# Altium schematic sheet COIL-BOOST-10A.SchDoc: COIL-BOOST-10A-XX (part 2 of 2)
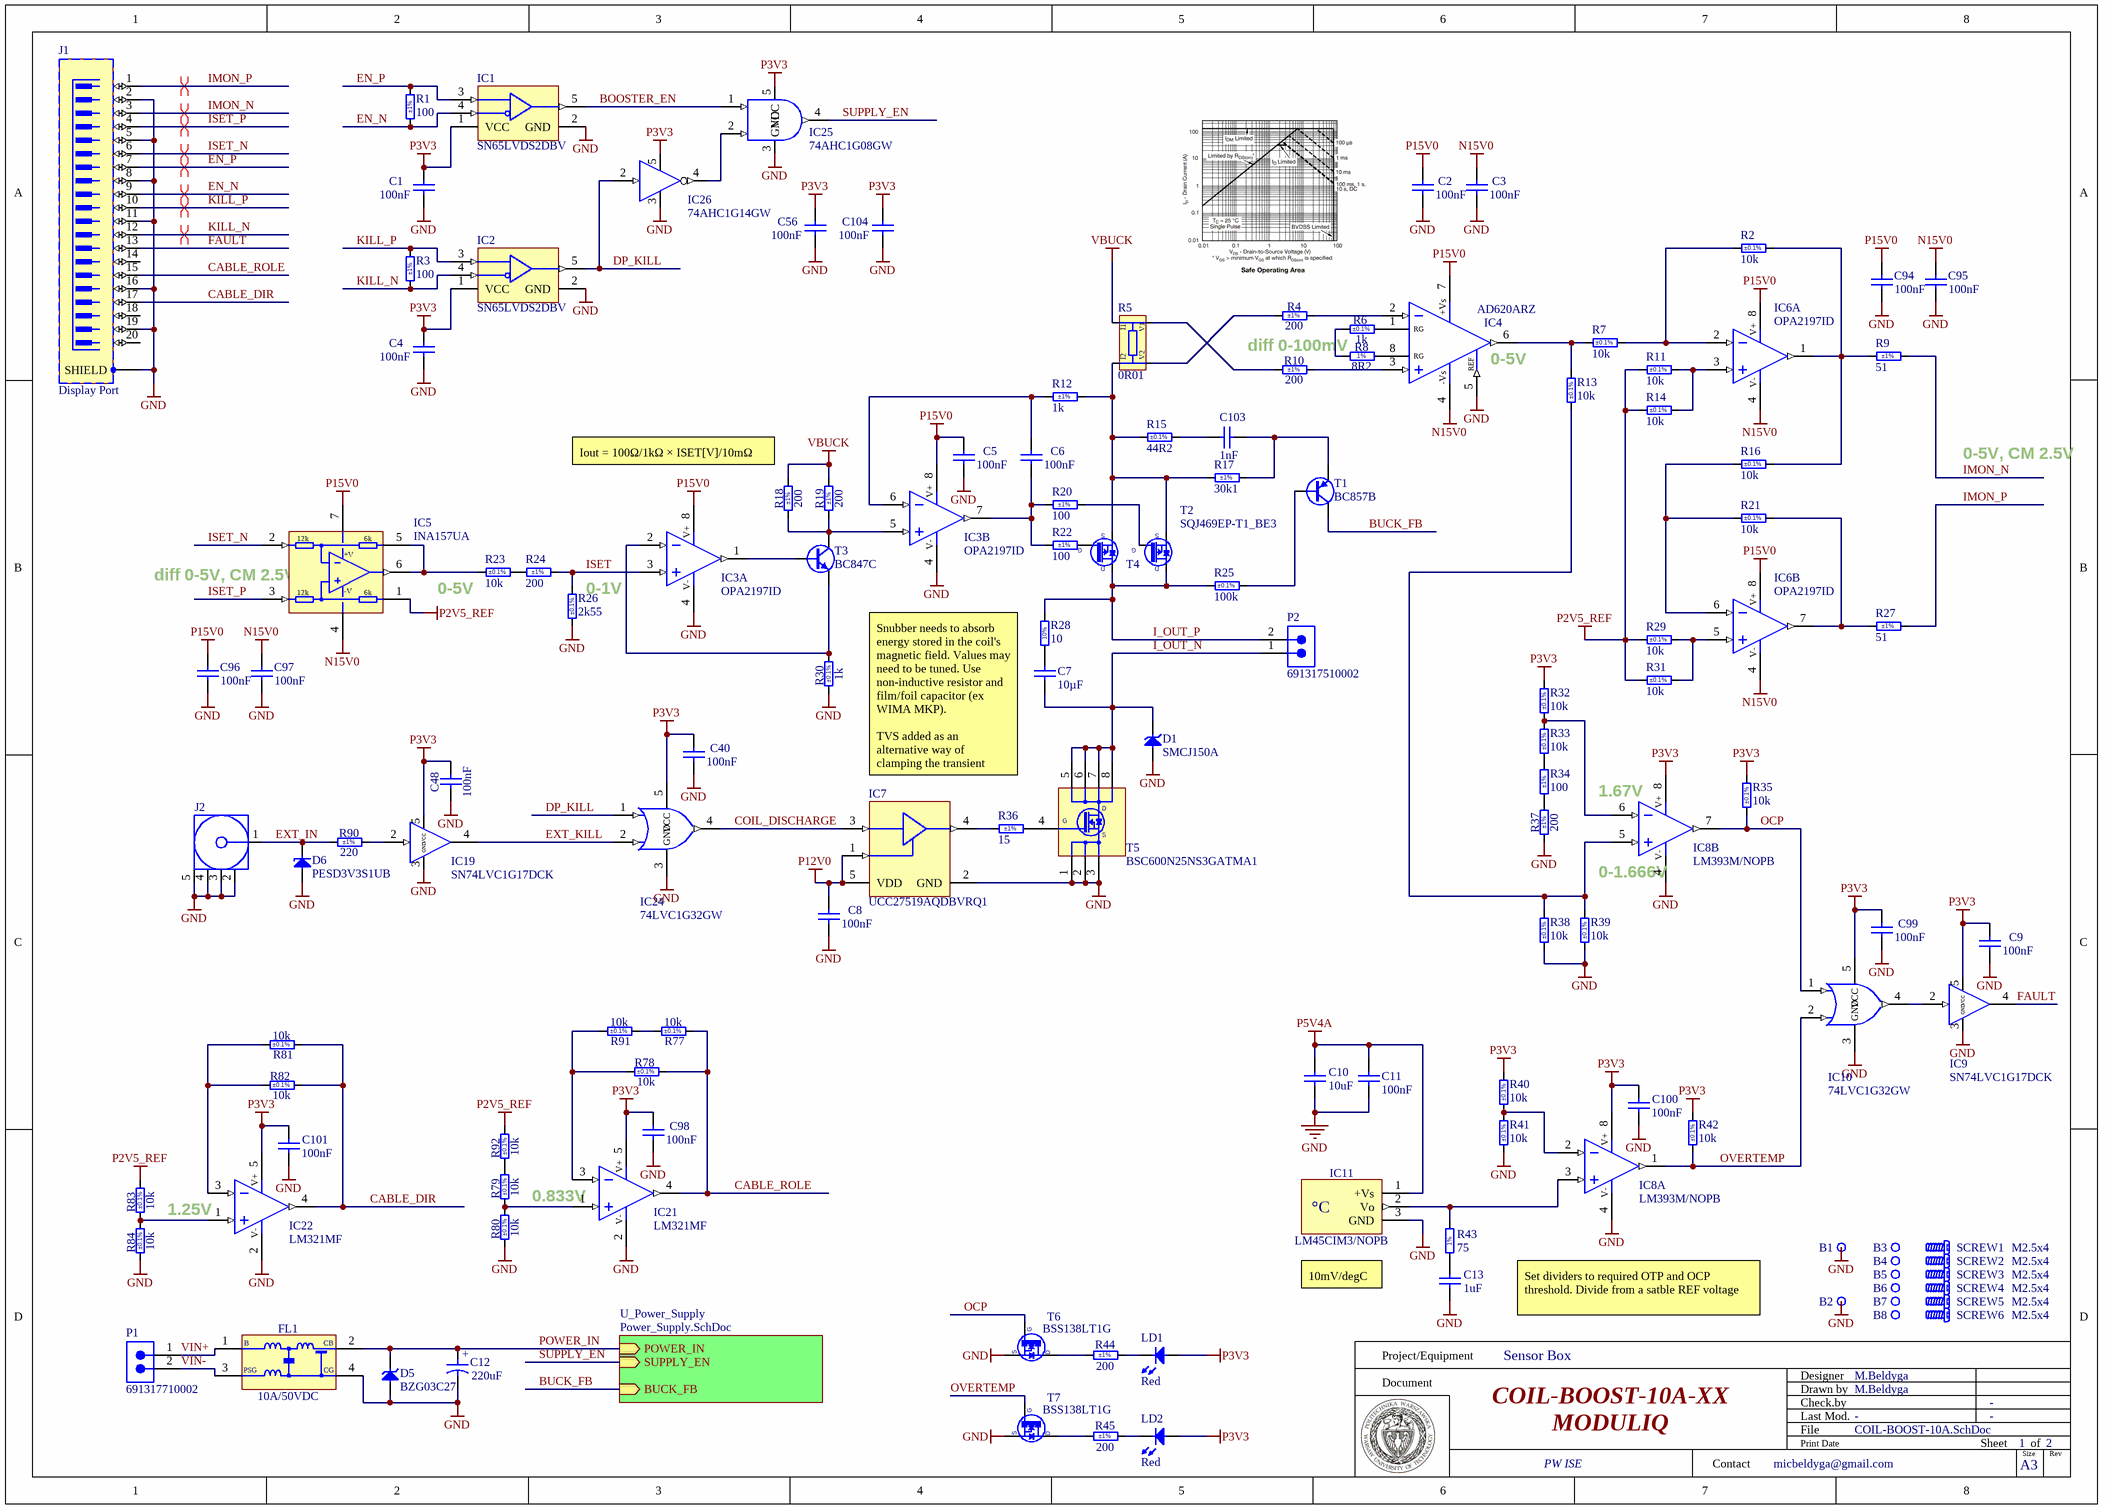
[diagram p1: COIL-BOOST-10A.SchDoc]

## Library data of the parts
B1-B8 = PLATED_HOLE2.7_PAD5.0: Single Terminal Socket; Part Description: Plated Through Hole: Hole Dia.=2.7mm Pad Dia.=5.0mm; Mounted: No; Part Number: PLATED_HOLE2.7_PAD5.0; Component Type: Standard (No BOM); Pin Count: 1; Family: Plated Hole; Socket: No; SMD: No; Sense: No; Status: None; ComponentHeight: 0mm; HelpURL: Undefined; Author: CERN DEM JMW; CreateDate: 27.09.2011; LatestRevisionDate: 27.09.2011; PackageDescription: Plated Through Hole: Hole Dia.=2.7mm Pad Dia.=5.0mm
C1-C6 C8 C9 C40 C56 C94-C101 C104 = CC0402_100NF_16V_10%_X5R: Non-polarised capacitor; Part Description: SMD Multilayer Chip Ceramic Capacitor; Manufacturer: GENERIC; Manufacturer1 Part Number: GRM155R61C104KA88D; Voltage: 16V; TC: X5R; Tolerance: ±10%; Part Number: CC0402_100NF_16V_10%_X5R; Component Kind: Standard; Component Type: Standard; Pin Count: 2; Value: 100nF; Status: None; Manufacturer Part Number: CC0402_100NF_16V_10%_X5R; Case: 0402; Mounted: Yes; Socket: No; SMD: Yes; Sense: No; Manufacturer1 Example: MURATA; Manufacturer1 ComponentHeight: 0.55mm; HelpURL: \\cern.ch\dfs\Applications\Altium\Datasheets\CC0402_X5R_MURATA_GRM.pdf; Author: CERN DEM JLC; CreateDate: 10.12.2013; LatestRevisionDate: 10.12.2013
C7 = R71XR510050H0K: Film Capacitor, Polypropylene, 450V, 10% +Tol, 10% -Tol, 10uF, Through Hole Mount; Manufacturer: KEMET; ESR (Equivalent Series Resistance): 10mΩ; Ripple Current: 8.68A; Voltage Rating (AC): 160V; Supplier: DigiKey; Supplier Part Number: 399-R71XR510050H0K-ND; Manufacturer Part Number: R71XR510050H0K; RoHS: Compliant; Category: Film Capacitors; Stock: 290; Pricing: 1=4.71, 10=3.387, 50=2.8622, 176=2.58898, 528=2.41778, 1056=2.33397, 2640=2.24539 (USD); Value: 10µF; Case/Package: Radial; Contact Plating: Tin; Dielectric Material: Polypropylene; Height: 28mm; Length: 32mm; Lifecycle Status: Production; Max Operating Temperature: 125°C; Min Operating Temperature: -55°C; Number of Terminals: 2; REACH SVHC: Yes; Terminal Pitch: 27.5mm; Voltage Rating (DC): 450V; Width: 14mm; ComponentLink1URL: https://datasheet.octopart.com:443/R71XR510050H0K-KEMET-datasheet-182036269.pdf?src-supplier=Newark; ComponentLink1Description: https://datasheet.octopart.com:443/R71XR510050H0K-KEMET-datasheet-182036269.pdf?src-supplier=Newark; ComponentLink2URL: https://datasheet.octopart.com:443/R71XR510050H0K-KEMET-datasheet-155475596.pdf?src-supplier=Newark; ComponentLink2Description: https://datasheet.octopart.com:443/R71XR510050H0K-KEMET-datasheet-155475596.pdf?src-supplier=Newark; ComponentLink3URL: https://datasheet.octopart.com:443/R71XR510050H0K-KEMET-datasheet-181969059.pdf?src-supplier=Farnell; ComponentLink3Description: https://datasheet.octopart.com:443/R71XR510050H0K-KEMET-datasheet-181969059.pdf?src-supplier=Farnell
C10 = CC0603_10UF_10V_10%_X5R: Non-polarised capacitor; Part Description: SMD Multilayer Chip Ceramic Capacitor; Manufacturer: GENERIC; Manufacturer1 Part Number: GRM188R61A106KE69D; Voltage: 10V; TC: X5R; Tolerance: ±10%; Part Number: CC0603_10UF_10V_10%_X5R; Component Kind: Standard; Component Type: Standard; Pin Count: 2; Value: 10uF; Status: None; Manufacturer Part Number: CC0603_10UF_10V_10%_X5R; Case: 0603; Mounted: Yes; Socket: No; SMD: Yes; Sense: No; Manufacturer1 Example: MURATA; Manufacturer1 ComponentHeight: 0.8mm; HelpURL: \\cern.ch\dfs\Applications\Altium\Datasheets\CC0603_MURATA_GRM188R61A106KE69D.pdf; Author: CERN DEM JLC; CreateDate: 31.01.2017; LatestRevisionDate: 31.01.2017
C11 = CC0402_100NF_50V_10%_X7R: Non-polarised capacitor; Part Description: SMD Multilayer Chip Ceramic Capacitor; Manufacturer: GENERIC; Manufacturer1 Part Number: GRM155R71H104KE14D; Voltage: 50V; TC: X7R; Tolerance: ±10%; Part Number: CC0402_100NF_50V_10%_X7R; Component Kind: Standard; Component Type: Standard; Pin Count: 2; Value: 100nF; Status: None; Manufacturer Part Number: CC0402_100NF_50V_10%_X7R; Case: 0402; Mounted: Yes; Socket: No; SMD: Yes; Sense: No; Manufacturer1 Example: MURATA; Manufacturer1 ComponentHeight: 0.55mm; HelpURL: \\cern.ch\dfs\Applications\Altium\Datasheets\CC0402_MURATA_GRM155R71H104KE14D.pdf; Author: CERN DEM MR; CreateDate: 6/30/2017; LatestRevisionDate: 6/30/2017
C12 = CAE830-620_220UF_16V_20%: Polarised capacitor; Part Description: Aluminum Electrolytic SMT Capacitor; Manufacturer: PANASONIC; Manufacturer Part Number: EEEFK1C221AP; Voltage: 16V; Tolerance: ±20%; Part Number: CAE830-620_220UF_16V_20%; Component Kind: Standard; Component Type: Standard; Pin Count: 2; Value: 220uF; Status: Not Recommended; Case: E; Mounted: Yes; Socket: No; SMD: Yes; Sense: No; ComponentHeight: 6.2mm; HelpURL: \\cern.ch\dfs\Applications\Altium\Datasheets\CAE_PANASONIC_FK.pdf; Author: CERN DEM JLC; CreateDate: 03.12.2007; LatestRevisionDate: 05.11.2014; Manufacturer1 Part Number: EEEFK1C221AP
C13 = CC0402_1UF_16V_10%_X5R: Non-polarised capacitor; Part Description: SMD Multilayer Chip Ceramic Capacitor; Manufacturer: GENERIC; Manufacturer1 Part Number: C1005X5R1C105KT; Voltage: 16V; TC: X5R; Tolerance: ±10%; Part Number: CC0402_1UF_16V_10%_X5R; Component Kind: Standard; Component Type: Standard; Pin Count: 2; Value: 1uF; Status: Preferred; Manufacturer Part Number: CC0402_1UF_16V_10%_X5R; Case: 0402; Mounted: Yes; Socket: No; SMD: Yes; Sense: No; Manufacturer1 Example: TDK; Manufacturer1 ComponentHeight: 0.55mm; HelpURL: \\cern.ch\dfs\Applications\Altium\Datasheets\CC0402_X5R_TDK_C.pdf; Author: CERN DEM JLC; CreateDate: 25.10.2012; LatestRevisionDate: 25.10.2012
C48 = CC0402_100NF_16V_10%_X7R: Non-polarised capacitor; Part Description: SMD Multilayer Chip Ceramic Capacitor; Manufacturer: GENERIC; Manufacturer1 Part Number: GRM155R71C104KA88D; Voltage: 16V; TC: X7R; Tolerance: ±10%; Part Number: CC0402_100NF_16V_10%_X7R; Component Kind: Standard; Component Type: Standard; Pin Count: 2; Value: 100nF; Status: Not Recommended; Manufacturer Part Number: CC0402_100NF_16V_10%_X7R; Case: 0402; Mounted: Yes; Socket: No; SMD: Yes; Sense: No; Manufacturer1 Example: MURATA; Manufacturer1 ComponentHeight: 0.55mm; HelpURL: \\cern.ch\dfs\Applications\Altium\Datasheets\CC0402_X7R_MURATA_GRM.pdf; Author: CERN DEM JLC; CreateDate: 05.12.2013; LatestRevisionDate: 03.12.2007
C103 = CC0402_1NF_50V_5%_C0G: Non-polarised capacitor; Part Description: SMD Multilayer Chip Ceramic Capacitor; Manufacturer: GENERIC; Manufacturer1 Part Number: C0402C102J5GACTU; Voltage: 50V; TC: C0G/NP0; Tolerance: ±5%; Part Number: CC0402_1NF_50V_5%_C0G; Component Kind: Standard; Component Type: Standard; Pin Count: 2; Value: 1nF; Status: Preferred; Manufacturer Part Number: CC0402_1NF_50V_5%_C0G; Case: 0402; Mounted: Yes; Socket: No; SMD: Yes; Sense: No; Manufacturer1 Example: KEMET; Manufacturer1 ComponentHeight: 0.55mm; HelpURL: \\cern.ch\dfs\Applications\Altium\Datasheets\CC0402_C0G_KEMET_(Commercial Grade).pdf; Author: CERN DEM BC; CreateDate: 9/2/2019; LatestRevisionDate: 9/2/2019
D1 = SMCJ150A: Transient Voltage Suppressor Diode (Uni-Directional); Part Description: Uni-Directional Transient Voltage Suppressor Diode; Manufacturer: LITTELFUSE; Voltage: 150V; Power: 1500W; PressFit: No; Bonding: No; Part Number: SMCJ150A; Component Kind: Standard; Component Type: Standard; Device: SMCJ150A; PackageDescription: DO-214-AB/SMC Molded Diode, Body 7.9x5.9mm, IPC Medium Density; Manufacturer Part Number: SMCJ150A; Pin Count: 2; Case: DO-214AB; Mounted: Yes; Socket: No; SMD: Yes; Sense: No; ComponentHeight: 2.62mm; HelpURL: \\cern.ch\dfs\Applications\Altium\Datasheets\SMCJ.pdf; Author: CERN DEM BC; CreateDate: 11/2/2015; LatestRevisionDate: 11/2/2015
D5 = BZG03C27: Zener Diode; Part Description: Voltage Regulator Diode; Manufacturer: VISHAY SEMICONDUCTORS; Voltage: 27V; Power: 1.25W; PressFit: No; Bonding: No; Part Number: BZG03C27; Component Kind: Standard; Component Type: Standard; Device: BZG03C27; PackageDescription: DO-214-AC/SMA Molded Diode, Body 5.3x2.6mm, IPC Medium Density; Manufacturer Part Number: BZG03C27; Pin Count: 2; Case: DO-214AC; Mounted: Yes; Socket: No; SMD: Yes; Sense: No; ComponentHeight: 2.3mm; HelpURL: \\cern.ch\dfs\Applications\Altium\Datasheets\BZG03C.pdf; Author: CERN DEM JLC; CreateDate: 6/2/2008; LatestRevisionDate: 6/2/2008
D6 = PESD3V3S1UB: ESD protection diode; Part Description: ESD protection diode (23kV); Manufacturer: NXP SEMICONDUCTORS; Voltage: 3V3; Power: 330W; PressFit: No; Bonding: No; Part Number: PESD3V3S1UB; Component Kind: Standard; Component Type: Standard; Device: PESD3V3S1UB; PackageDescription: Ultra Small Outline Diode Flat Lead (SOD-523), Body; 1.2mm L X 0.8mm W X 0.65mm H, IPC Medium Density; Manufacturer Part Number: PESD3V3S1UB; Pin Count: 2; Case: SOD523; Mounted: Yes; Socket: No; SMD: Yes; Sense: No; ComponentHeight: 0.65mm; HelpURL: \\cern.ch\dfs\Applications\Altium\Datasheets\PESD3V3S1UB.pdf; Author: CERN DEM JLC; CreateDate: 11/29/2012; LatestRevisionDate: 11/29/2012
FL1 = FIL_MURATA_BNX022-01L: Block Type EMIFIL (LC Combined); Part Description: Block Type EMIFIL (LC Combined) SMD Type, BNX02* Series; Manufacturer1: MURATA; Resistance: 0.5R; Part Number: FIL_MURATA_BNX022-01L; Component Kind: Standard; Component Type: Standard; Pin Count: 2; Value: 10A/50VDC; Status: None; Manufacturer1 Part Number: BNX022-01L; Mounted: Yes; Socket: No; SMD: Yes; Sense: No; ComponentHeight: 3.3mm; HelpURL: \\cern.ch\dfs\Applications\Altium\Datasheets\FIL_MURATA_BNX022-01L.pdf; Author: CERN DEM JLC; CreateDate: 10.10.2012; LatestRevisionDate: 10.10.2012
IC1 IC2 = SN65LVDS2DBVR: High-Speed Differential Line Receiver; Manufacturer: TEXAS INSTRUMENTS; PressFit: No; Bonding: No; Part Number: SN65LVDS2DBVR; Component Kind: Standard; Component Type: Standard; Device: SN65LVDS2DBV; PackageDescription: SOT, 0.95mm Pitch; 5 Pin, 1.60mm W X 2.90mm L X 1.45mm H body, IPC Medium Density; Part Description: High-Speed Differential Line Receiver; Manufacturer Part Number: SN65LVDS2DBV; Pin Count: 5; Case: SOT23-5; Mounted: Yes; Socket: No; SMD: Yes; Sense: No; ComponentHeight: 1.45mm; Author: CERN DEM JLC; HelpURL: \\cern.ch\dfs\Applications\Altium\Datasheets\SN65LVDS2DBVR.pdf; CreateDate: 3/3/2011; LatestRevisionDate: 3/3/2023
IC3 IC6 = OPA2197ID: Dual Operational Amplifier; Part Description: Dual, 36-V, Precision, Rail-to-Rail Input/Output, Low Offset Voltage, Operational Amplifiers; Manufacturer: TEXAS INSTRUMENTS; PressFit: No; Bonding: No; Part Number: OPA2197ID; Component Kind: Standard; Component Type: Standard; Device: OPA2197ID; PackageDescription: SOIC 8, Pitch 1.27mm - Body 4x5mm, IPC Medium Density; Manufacturer Part Number: OPA2197ID; Pin Count: 8; Case: SOIC8; Mounted: Yes; Socket: No; SMD: Yes; Sense: No; ComponentHeight: 1.75mm; Author: CERN DEM MR; HelpURL: \\cern.ch\dfs\Applications\Altium\Datasheets\OPA2197ID.pdf; CreateDate: 8/7/2019; LatestRevisionDate: 8/7/2019
IC4 = AD620ARZ: Low Cost Low Power Instrumentation Amplifier; Manufacturer1: ANALOG DEVICES; Manufacturer1 Part Number: AD620ARZ-REEL7; PressFit: No; Bonding: No; Part Number: AD620ARZ; Component Kind: Standard; Component Type: Standard; Device: AD620ARZ; PackageDescription: SOIC 8, Pitch 1.27mm - Body 4x5mm, IPC Medium Density; Part Description: Low Cost Low Power Instrumentation Amplifier; Pin Count: 8; Case: SOIC8; Mounted: Yes; Socket: No; SMD: Yes; Sense: No; ComponentHeight: 1.75mm; Author: CERN DEM JLC; HelpURL: \\cern.ch\dfs\Applications\Altium\Datasheets\AD620ARZ.pdf; CreateDate: 13.02.2017; LatestRevisionDate: 29.03.2022
IC5 = INA157UA: IC OPAMP DIFF 1 CIRCUIT 8SOIC Differential Amplifier 1 Circuit 8-SOIC; Manufacturer: Texas Instruments; Manufacturer Lifecycle Status: ACTIVE; -3db Bandwidth: 4MHz; Common Mode Rejection Ratio: 80dB; Dual Supply Voltage: 15V; Gain Bandwidth Product: 3MHz; Input Offset Voltage (Vos): 100µV; Max Dual Supply Voltage: 18V; Min Dual Supply Voltage: 4V; Min Supply Voltage: 8V; Nominal Supply Current: 2.4mA; Number of Amplifiers: 1; Number of Channels: 2; Output Current per Channel: 60mA; Value: 24kΩ; Settling Time: 2ns; Slew Rate: 14V/µs; Voltage Gain: 6.02dB; Supplier: DigiKey; Supplier Part Number: INA157UA-ND; Manufacturer Part Number: INA157UA; RoHS: Compliant; Category: Amplifiers - Op Amps, Buffer, Instrumentation; Stock: 608; Pricing: 1=3.99, 10=3.019, 75=2.55467, 150=2.44673, 300=2.35783, 525=2.2977, 1050=2.23519, 2550=2.17103 (USD); Case/Package: SOIC; Height: 1.75mm; Lead Free: Lead Free; Length: 4.9mm; Lifecycle Status: Production; Max Supply Voltage: 18V; Max Operating Temperature: 85°C; Min Input Voltage: 4V; Min Operating Temperature: -40°C; Number of Circuits: 1; Number of Elements: 1; Pins: 8; Operating Supply Current: 2.4mA; Quiescent Current: 2.4mA; Radiation Hardening: No; REACH SVHC: No; Thickness: 1.58mm; Weight: 75.891673mg; Width: 3.91mm; ComponentLink1URL: https://sigma.octopart.com:443/49249642/technical_drawing/Texas-Instruments-INA157UA.pdf?src-supplier=Texas+Instruments; ComponentLink1Description: https://sigma.octopart.com:443/49249642/technical_drawing/Texas-Instruments-INA157UA.pdf?src-supplier=Texas+Instruments; ComponentLink2URL: https://octopart.com:443/opatz8j6/c1?t=U1EGlDNQZqLQs-EwIsscqEEx-AfnVOllSlN4p0sh4PLdG1CcVMKRtmhTNlN5f_Uh_vUGKP152rEL5GLEXC8DNZuiG5tbL9tPH-teoooIFRknLMdlw0_Jv4zBSHnT4PvLcvwFqHgDMUmN8-CU-c3UHujaNllWAgd-PDXByNTyJSuUkuVnwLSvEPkd0Q_esnRAQitWnREmUgqmclHl2b6W6tCFcyWDuRzDd4IkS-8MZ59sgpEPanuaKX1qGjiQLPbd3OG0klFAyskjpNKaHTZEnEYEGL77h_GEymF0r_g3ACZDzpib4ELj8IvhiwXeMcRieELbSgYPCbUTcjZO1RvHbL2-kGPWqPzznfkJGrgq9ClaUaTRrtnm5Mq_6ye76DY4o9A&src-supplier=Texas+Instruments; ComponentLink2Description: https://octopart.com:443/opatz8j6/c1?t=U1EGlDNQZqLQs-EwIsscqEEx-AfnVOllSlN4p0sh4PLdG1CcVMKRtmhTNlN5f_Uh_vUGKP152rEL5GLEXC8DNZuiG5tbL9tPH-teoooIFRknLMdlw0_Jv4zBSHnT4PvLcvwFqHgDMUmN8-CU-c3UHujaNllWAgd-PDXByNTyJSuUkuVnwLSvEPkd0Q_esnRAQitWnREmUgqmclHl2b6W6tCFcyWDuRzDd4IkS-8MZ59sgpEPanuaKX1qGjiQLPbd3OG0klFAyskjpNKaHTZEnEYEGL77h_GEymF0r_g3ACZDzpib4ELj8IvhiwXeMcRieELbSgYPCbUTcjZO1RvHbL2-kGPWqPzznfkJGrgq9ClaUaTRrtnm5Mq_6ye76DY4o9A&src-supplier=Texas+Instruments; ComponentLink3URL: https://datasheet.octopart.com:443/INA157UA-Texas-Instruments-datasheet-152917.pdf?src-supplier=Texas+Instruments; ComponentLink3Description: https://datasheet.octopart.com:443/INA157UA-Texas-Instruments-datasheet-152917.pdf?src-supplier=Texas+Instruments; ComponentLink4URL: https://datasheet.octopart.com:443/INA157UA-Texas-Instruments-datasheet-10257352.pdf?src-supplier=element14+APAC; ComponentLink4Description: https://datasheet.octopart.com:443/INA157UA-Texas-Instruments-datasheet-10257352.pdf?src-supplier=element14+APAC; ComponentLink5URL: https://datasheet.octopart.com:443/INA157UA-Texas-Instruments-datasheet-30905.pdf?src-supplier=DigiKey; ComponentLink5Description: https://datasheet.octopart.com:443/INA157UA-Texas-Instruments-datasheet-30905.pdf?src-supplier=DigiKey; ComponentLink6URL: https://datasheet.octopart.com:443/INA157UA-Texas-Instruments-datasheet-14140569.pdf?src-supplier=iiiC; ComponentLink6Description: https://datasheet.octopart.com:443/INA157UA-Texas-Instruments-datasheet-14140569.pdf?src-supplier=iiiC; ComponentLink7URL: https://datasheet.octopart.com:443/INA157UA-Texas-Instruments-datasheet-8443426.pdf?src-supplier=Jameco; ComponentLink7Description: https://datasheet.octopart.com:443/INA157UA-Texas-Instruments-datasheet-8443426.pdf?src-supplier=Jameco; ComponentLink8URL: http://sigma.octopart.com:80/reach_statement/Texas-Instruments-company-64.pdf?src-supplier=Compliance+Statements; ComponentLink8Description: http://sigma.octopart.com:80/reach_statement/Texas-Instruments-company-64.pdf?src-supplier=Compliance+Statements; ComponentLink9URL: http://sigma.octopart.com:80/conflict_mineral_statement/Texas-Instruments-company-63.pdf?src-supplier=Compliance+Statements; ComponentLink9Description: http://sigma.octopart.com:80/conflict_mineral_statement/Texas-Instruments-company-63.pdf?src-supplier=Compliance+Statements
IC7 = UCC27519AQDBVRQ1: Single-Channel High-Speed Low-Side Gate Driver With Negative Input  Voltage Capability; Manufacturer: TEXAS INSTRUMENTS; PressFit: No; Bonding: No; Part Number: UCC27519AQDBVRQ1; Component Kind: Standard; Component Type: Standard; Device: UCC27519AQDBVRQ1; PackageDescription: SOT, 0.95mm Pitch; 5 pin, 1.60mm W X 2.90mm L X 1.45mm H body, IPC Medium Density; Part Description: Single-Channel High-Speed Low-Side Gate Driver with Negative Input  Voltage Capability; Manufacturer Part Number: UCC27519AQDBV; Pin Count: 5; Case: SOT23-5; Mounted: Yes; Socket: No; SMD: Yes; Sense: No; ComponentHeight: 1.45mm; Author: CERN DEM JLC; HelpURL: \\cern.ch\dfs\Applications\Altium\Datasheets\UCC27519AQDBVRQ1.pdf; CreateDate: 7/16/2018; LatestRevisionDate: 6/13/2022
IC8 = LM393M/NOPB: Dual Operational Amplifier; Part Description: Low Power Low Offset Voltage Dual Comparators; Manufacturer: NATIONAL SEMICONDUCTOR; Manufacturer Part Number: LM393M; PressFit: No; Bonding: No; Part Number: LM393M/NOPB; Component Kind: Standard; Component Type: Standard; Device: LM393M/NOPB; PackageDescription: SOIC 8, Pitch 1.27mm - Body 4x5mm, IPC Medium Density; Pin Count: 8; Case: SOIC8; Mounted: Yes; Socket: No; SMD: Yes; Sense: No; ComponentHeight: 1.75mm; Author: CERN DEM JLC; HelpURL: \\cern.ch\dfs\Applications\Altium\Datasheets\LM393M-NOPB.pdf; CreateDate: 11/18/2011; LatestRevisionDate: 6/2/2022
IC9 IC19 = SN74LVC1G17DCK: Single Schmitt-Trigger Buffer; Manufacturer: TEXAS INSTRUMENTS; PressFit: No; Bonding: No; Part Number: SN74LVC1G17DCK; Component Kind: Standard; Component Type: Standard; Device: SN74LVC1G17DCK; PackageDescription: SOT353, SC70-5, 0.65mm Pitch; 5 Pin, 1.25mm W X 2.00mm L X 1.10mm H body, IPC Medium Density; Part Description: Single Schmitt-Trigger Buffer; Manufacturer Part Number: SN74LVC1G17DCK; Pin Count: 5; Case: SOT353; Mounted: Yes; Socket: No; SMD: Yes; Sense: No; ComponentHeight: 1.45mm; Author: CERN DEM HF; HelpURL: \\cern.ch\dfs\Applications\Altium\Datasheets\SN74LVC1G17.pdf; CreateDate: 05.12.2024; LatestRevisionDate: 05.12.2024
IC10 IC24 = 74LVC1G32GW: Single 2-Input Positive-OR Gate; Part Description: Single 2-input OR gate; Manufacturer: NXP SEMICONDUCTORS; PressFit: No; Bonding: No; Part Number: 74LVC1G32GW; Component Kind: Standard; Component Type: Standard; Device: 74LVC1G32GW; PackageDescription: SOT353, SC70-5, 0.65mm Pitch; 5 Pin, 1.25mm W X 2.05mm L X 1.10mm H body, IPC Medium Density; Manufacturer Part Number: 74LVC1G32GW; Pin Count: 5; Case: SOT353; Mounted: Yes; Socket: No; SMD: Yes; Sense: No; ComponentHeight: 1.1mm; Author: CERN DEM JLC; HelpURL: \\cern.ch\dfs\Applications\Altium\Datasheets\74LVC1G32GW.pdf; CreateDate: 11/25/2013; LatestRevisionDate: 11/25/2013
IC11 = LM45CIM3/NOPB: -20° to +100°C ±3°C Precision Centigrade Temperature Sensors; Manufacturer: TEXAS INSTRUMENTS; PressFit: No; Bonding: No; Part Number: LM45CIM3/NOPB; Component Kind: Standard; Component Type: Standard; Device: LM45CIM3/NOPB; PackageDescription: SOT, 0.95mm Pitch; 3 Pin, 1.30mm W X 2.92mm L X 1.12mm H body, IPC Medium Density; Part Description: -20° to +100°C ±3°C Precision Centigrade Temperature Sensors; Manufacturer Part Number: LM45CIM3/NOPB; Pin Count: 3; Case: SOT23; Mounted: Yes; Socket: No; SMD: Yes; Sense: No; ComponentHeight: 1.12mm; HelpURL: \\cern.ch\dfs\Applications\Altium\Datasheets\LM45CIM3-NOPB.pdf; Author: CERN DEM JLC; CreateDate: 19/01/2011; LatestRevisionDate: 19/01/2011
IC21 IC22 = LM321MF/NOPB: Low Power Single Operational Amplifier; Manufacturer: TEXAS INSTRUMENTS; PressFit: No; Bonding: No; Part Number: LM321MF/NOPB; Component Kind: Standard; Component Type: Standard; Device: LM321MF; PackageDescription: SOT, 0.95mm Pitch; 5 Pin, 1.60mm W X 2.90mm L X 1.45mm H body, IPC Medium Density; Part Description: Low Power Single Operational Amplifier; Manufacturer Part Number: LM321MF; Pin Count: 5; Case: SOT23-5; Mounted: Yes; Socket: No; SMD: Yes; Sense: No; ComponentHeight: 1.45mm; Author: CERN DEM BC; HelpURL: \\cern.ch\dfs\Applications\Altium\Datasheets\LM321MF-NOPB.pdf; CreateDate: 9/4/2015; LatestRevisionDate: 6/1/2022
IC25 = 74AHC1G08GW: Single 2-Input AND Gate; Manufacturer: NXP SEMICONDUCTORS; PressFit: No; Bonding: No; Part Number: 74AHC1G08GW; Component Kind: Standard; Component Type: Standard; Device: 74AHC1G08GW; PackageDescription: SOT353, SC70-5, 0.65mm Pitch; 5 Pin, 1.25mm W X 2.05mm L X 1.10mm H body, IPC Medium Density; Part Description: Single 2-Input AND Gate; Manufacturer Part Number: 74AHC1G08GW; Pin Count: 5; Case: SOT353; Mounted: Yes; Socket: No; SMD: Yes; Sense: No; ComponentHeight: 1.1mm; Author: CERN DEM JLC; HelpURL: \\cern.ch\dfs\Applications\Altium\Datasheets\74AHC1G08GW.pdf; CreateDate: 8/31/2010; LatestRevisionDate: 8/31/2010
IC26 = 74AHC1G14GW: Single Schmitt-Trigger Inverter; Part Description: Inverting Schmitt Trigger; Manufacturer: NXP SEMICONDUCTORS; PressFit: No; Bonding: No; Part Number: 74AHC1G14GW; Component Kind: Standard; Component Type: Standard; Device: 74AHC1G14GW; PackageDescription: SOT353, SC70-5, 0.65mm Pitch; 5 Pin, 1.25mm W X 2.05mm L X 1.10mm H body, IPC Medium Density; Manufacturer Part Number: 74AHC1G14GW; Pin Count: 3; Case: SOT353; Mounted: Yes; Socket: No; SMD: Yes; Sense: No; ComponentHeight: 1.1mm; Author: CERN DEM JMW; HelpURL: \\cern.ch\dfs\Applications\Altium\Datasheets\74AHC1G14GW.pdf; CreateDate: 8/30/2016; LatestRevisionDate: 8/30/2016
J1 = MOLEX_47272-0001: Connector Mini DisplayPort 20 Male + 1 Shield; Part Description: 20 Circuits, 0.50mm Pitch, Right Angle DisplayPort Male Receptacle; Manufacturer: MOLEX; PressFit: No; Part Number: MOLEX_47272-0001; Component Kind: Standard; Component Type: Standard; Pin Count: 21; Family: Display Port; Mounted: Yes; Socket: No; SMD: Yes; Sense: No; Status: None; Manufacturer Part Number: 47272-0001; ComponentHeight: 5.63mm; HelpURL: \\cern.ch\dfs\Applications\Altium\Datasheets\MOLEX_47272-0001.pdf; Author: CERN DEM JLC; CreateDate: 2/5/2015; LatestRevisionDate: 2/5/2015
J2 = 60611002111502: WR-MCX PCB Jack, THT, Right Angle, Solder Leg 1.73mm; Manufacturer: Wurth Elektronik; Center Contact Diameter: 0.96mm; Connector Type: MCX; Frequency Range: DC~6GHz; Impedance: 50Ω; Interface Type: IEC 61169-36; ComponentLink1Description: Website Link; ComponentLink1URL: https://www.we-online.com/redexpert/article/60611002111502?ad; ComponentLink2Description: Datasheet Link; ComponentLink2URL: https://www.we-online.com/redexpert/spec/60611002111502?ad; Manufacturer Part Number: 60611002111502; Category: Coaxial Connectors; Match Code: WR-MCX; Mount: Through Hole; Operating Temperature Max: 155°C; Operating Temperature Min: -55°C; Packaging: Tray; Gender: Jack; Orientation: Right Angle
LD1 LD2 = LED_AVAGO_HSMC-C120: LED Red 1C 2A; Part Description: High Performance Right Angle Chip Red LED; Manufacturer: AVAGO TECHNOLOGIES; PressFit: No; Bonding: No; Part Number: LED_AVAGO_HSMC-C120; Component Kind: Standard; Component Type: Standard; Color: Red; PackageDescription: Red Chip LED, 2-Leads, Body 1.7x1.1mm, Side Emitting Package; Status: Not Recommended; Manufacturer Part Number: HSMC-C120; Pin Count: 2; Mounted: Yes; Socket: No; SMD: Yes; Sense: No; ComponentHeight: 0.7mm; HelpURL: \\cern.ch\dfs\Applications\Altium\Datasheets\LED_AVAGO_HSMC-C120.pdf; ComponentLink1URL: \\cern.ch\dfs\Applications\Altium\Datasheets\LED_AVAGO_HSMC-C120_DESIGN-GUIDE.pdf; ComponentLink1Description: Design Guide; Author: CERN DEM JMW; CreateDate: 7/22/2009; LatestRevisionDate: 6/20/2012
P1 = 691317710002: WR-TBL Series 3177 Close Horizontal PCB Header with Flanges, THT, pitch 5mm, 2p; Manufacturer: Wurth Elektronik; Modularity: No; Rated Current: 20A; Working Voltage: 300V; Manufacturer Part Number: 691317710002; Category: Terminal Blocks; Match Code: WR-TBL; ComponentLink1Description: Website Link; ComponentLink1URL: https://www.we-online.com/redexpert/article/691317710002?ad; ComponentLink2Description: Datasheet Link; ComponentLink2URL: https://www.we-online.com/redexpert/spec/691317710002?ad; Mount: Through Hole; Operating Temperature Max: 105°C; Operating Temperature Min: -40°C; Packaging: Box; Application: Pluggable; Number of Pins: 2; Number of Rows: 1; Orientation: Horizontal; Pitch: 5mm
P2 = 691317510002: WR-TBL Series 3175 Close Horizontal PCB Header with Flanges, THT, pitch 5.08mm, 2p; Manufacturer: Wurth Elektronik; Modularity: No; Rated Current: 20A; Working Voltage: 300V; Manufacturer Part Number: 691317510002; Category: Terminal Blocks; Match Code: WR-TBL; ComponentLink1Description: Website Link; ComponentLink1URL: https://www.we-online.com/redexpert/article/691317510002?ad; ComponentLink2Description: Datasheet Link; ComponentLink2URL: https://www.we-online.com/redexpert/spec/691317510002?ad; Mount: Through Hole; Operating Temperature Max: 105°C; Operating Temperature Min: -40°C; Packaging: Box; Application: Pluggable; Number of Pins: 2; Number of Rows: 1; Orientation: Horizontal; Pitch: 5.08mm
R1 R3 R20 R22 R34 = R0402_100R_1%_0.0625W_100PPM: Resistor - 1%; Part Description: General Purpose Thick Film Chip Resistor; Manufacturer: GENERIC; Manufacturer1 Part Number: 232270671001L; TC: ±100ppm/°C; PressFit: No; Part Number: R0402_100R_1%_0.0625W_100PPM; Component Kind: Standard; Component Type: Standard; Pin Count: 2; Value: 100; Status: Not Recommended; Power: 0.0625W; Manufacturer Part Number: R0402_100R_1%_0.0625W_100PPM; Case: 0402; Mounted: Yes; Sense: No; Socket: No; SMD: Yes; Manufacturer1 Example: YAGEO PHYCOMP; Manufacturer1 ComponentHeight: 0.4mm; HelpURL: \\cern.ch\dfs\Applications\Altium\Datasheets\R0402_Phycomp_RC0402.pdf; Author: CERN DEM JLC; CreateDate: 12/3/2007; LatestRevisionDate: 10/17/2012
R2 R7 R11 R13 R14 R16 R21 R23 R29 R31-R33 R35 R38-R42 R77-R84 R91 R92 = R0402_10K_0.1%_0.063W_25PPM: Resistor - 0.1%; Part Description: Thin Film Precision Resistor; Manufacturer: GENERIC; Manufacturer1 Part Number: CPF0402B10KE1; Power: 0.063W; TC: ±25ppm/°C; PressFit: No; Part Number: R0402_10K_0.1%_0.063W_25PPM; Component Kind: Standard; Component Type: Standard; Pin Count: 2; Value: 10k; Status: Not Recommended; Manufacturer Part Number: R0402_10K_0.1%_0.063W_25PPM; Case: 0402; Mounted: Yes; Sense: No; Socket: No; SMD: Yes; Manufacturer1 Example: TE CONNECTIVITY; Manufacturer1 ComponentHeight: 0.35mm; HelpURL: \\cern.ch\dfs\Applications\Altium\Datasheets\R0402_TYCO_CPF.pdf; Author: CERN DEM JMW; CreateDate: 9/22/2015; LatestRevisionDate: 9/22/2015
R4 R10 R18 R19 R37 R44 R45 = R0603_200R_1%_0.1W_100PPM: Resistor - 1%; Part Description: General Purpose Thick Film Chip Resistor; Manufacturer: GENERIC; Manufacturer1: Vishay; Manufacturer1 Part Number: CRCW0603200RFKEA; Power: 0.1W; TC: ±100ppm/°C; PressFit: No; Part Number: R0603_200R_1%_0.1W_100PPM; Component Kind: Standard; Component Type: Standard; Pin Count: 2; Value: 200; Status: Preferred; Manufacturer Part Number: R0603_200R_1%_0.1W_100PPM; Case: 0603; Mounted: Yes; Sense: No; Socket: No; SMD: Yes; Manufacturer1 ComponentHeight: 0.55mm; HelpURL: \\cern.ch\dfs\Applications\Altium\Datasheets\R0603_NIC_NRC.pdf; Author: CERN DEM JLC; CreateDate: 03.12.2007; LatestRevisionDate: 13.03.2008
R5 = R_0R01_1%_2W_100PPM_OHMITE_LVK25: Power and Current Sensing Resistor; Part Description: Four Terminal High Precision Current Sense; Manufacturer: OHMITE; Manufacturer Part Number: LVK25R010FER; Power: 2W; TC: ±100ppm/°C; Tolerance: ±1%; PressFit: No; Part Number: R_0R01_1%_2W_100PPM_OHMITE_LVK25; Component Kind: Standard; Component Type: Standard; Pin Count: 4; Value: 0R01; Status: None; Mounted: Yes; Sense: No; Socket: No; SMD: Yes; ComponentHeight: 0.7mm; HelpURL: \\cern.ch\dfs\Applications\Altium\Datasheets\R_OHMITE_LVK25.pdf; Author: CERN DEM BC; CreateDate: 9/7/2020; LatestRevisionDate: 9/7/2020
R6 R30 = R0603_1K_0.1%_0.063W_10PPM: Resistor - 0.1%; Part Description: Thin Film Chip Resistor; Manufacturer: GENERIC; Manufacturer1: TYCO HOLSWORTHY; Manufacturer1 Part Number: RN73C1J1K0BTG; Power: 0.063W; TC: ±10ppm; PressFit: No; Part Number: R0603_1K_0.1%_0.063W_10PPM; Component Kind: Standard; Component Type: Standard; Pin Count: 2; Value: 1k; Status: Not Recommended; Manufacturer Part Number: R0603_1K_0.1%_0.063W_10PPM; Case: 0603; Mounted: Yes; Sense: No; Socket: No; SMD: Yes; Manufacturer1 ComponentHeight: 0.55mm; HelpURL: \\cern.ch\dfs\Applications\Altium\Datasheets\R0603_Tyco_RN73.pdf; Author: CERN DEM BC; CreateDate: 23.05.2016; LatestRevisionDate: 23.05.2016
R8 = R0603_8R2_1%_0.1W_200PPM: Resistor - 1%; Part Description: General Purpose Thick Film Chip Resistor; Manufacturer: GENERIC; Manufacturer1: YAGEO PHYCOMP; Manufacturer1 Part Number: RC0603FR-078R2L; Power: 0.1W; TC: ±200ppm/°C; PressFit: No; Part Number: R0603_8R2_1%_0.1W_200PPM; Component Kind: Standard; Component Type: Standard; Pin Count: 2; Value: 8R2; Status: Preferred; Tolerance: ±1%; Manufacturer Part Number: R0603_8R2_1%_0.1W_200PPM; Case: 0603; Mounted: Yes; Sense: No; Socket: No; SMD: Yes; Manufacturer1 ComponentHeight: 0.65mm; HelpURL: \\cern.ch\dfs\Applications\Altium\Datasheets\R0603_Phycomp_RC0603.pdf; Author: CERN DEM JLC; CreateDate: 03/12/2007; LatestRevisionDate: 17/10/2012
R9 R27 = R0603_51R_1%_0.1W_100PPM: Resistor - 1%; Part Description: General Purpose Thick Film Chip Resistor; Manufacturer: GENERIC; Manufacturer1 Part Number: NRC06F51R0TRF; Power: 0.1W; TC: ±100ppm/°C; PressFit: No; Part Number: R0603_51R_1%_0.1W_100PPM; Component Kind: Standard; Component Type: Standard; Pin Count: 2; Value: 51; Status: Preferred; Manufacturer Part Number: R0603_51R_1%_0.1W_100PPM; Case: 0603; Mounted: Yes; Sense: No; Socket: No; SMD: Yes; Manufacturer1 Example: NIC COMPONENT; Manufacturer1 ComponentHeight: 0.55mm; HelpURL: \\cern.ch\dfs\Applications\Altium\Datasheets\R0603_NIC_NRC.pdf; Author: CERN DEM JLC; CreateDate: 12/3/2007; LatestRevisionDate: 3/13/2008
R12 = R0402_1K_1%_0.0625W_100PPM: Resistor - 1%; Part Description: General Purpose Thick Film Chip Resistor; Manufacturer: GENERIC; Manufacturer1 Part Number: 232270671002L; TC: ±100ppm/°C; PressFit: No; Part Number: R0402_1K_1%_0.0625W_100PPM; Component Kind: Standard; Component Type: Standard; Pin Count: 2; Value: 1k; Status: Not Recommended; Power: 0.0625W; Manufacturer Part Number: R0402_1K_1%_0.0625W_100PPM; Case: 0402; Mounted: Yes; Sense: No; Socket: No; SMD: Yes; Manufacturer1 Example: YAGEO PHYCOMP; Manufacturer1 ComponentHeight: 0.4mm; HelpURL: \\cern.ch\dfs\Applications\Altium\Datasheets\R0402_Phycomp_RC0402.pdf; Author: CERN DEM JLC; CreateDate: 12/3/2007; LatestRevisionDate: 10/17/2012
R15 = R0603_44R2_0.1%_0.063W_10PPM: Resistor - 0.1%; Part Description: Thin Film Chip Resistor; Manufacturer: GENERIC; Manufacturer1 Part Number: RN73C1J44R2BTDF; Power: 0.063W; TC: ±10ppm; PressFit: No; Part Number: R0603_44R2_0.1%_0.063W_10PPM; Component Kind: Standard; Component Type: Standard; Pin Count: 2; Value: 44R2; Status: Not Recommended; Manufacturer Part Number: R0603_44R2_0.1%_0.063W_10PPM; Case: 0603; Mounted: Yes; Sense: No; Socket: No; SMD: Yes; Manufacturer1 Example: TYCO HOLSWORTHY; Manufacturer1 ComponentHeight: 0.5mm; HelpURL: \\cern.ch\dfs\Applications\Altium\Datasheets\R0603_Tyco_RN73.pdf; Author: CERN DEM JLC; CreateDate: 12/3/2007; LatestRevisionDate: 3/13/2008
R17 = R0402_30K1_1%_0.0625W_100PPM: Resistor - 1%; Part Description: General Purpose Thick Film Chip Resistor; Manufacturer: GENERIC; Manufacturer1 Part Number: RC0402FR-0730K1L; TC: ±100ppm/°C; PressFit: No; Part Number: R0402_30K1_1%_0.0625W_100PPM; Component Kind: Standard; Component Type: Standard; Pin Count: 2; Value: 30k1; Status: Preferred; Power: 0.0625W; Manufacturer Part Number: R0402_30K1_1%_0.0625W_100PPM; Case: 0402; Mounted: Yes; Sense: No; Socket: No; SMD: Yes; Manufacturer1 Example: YAGEO PHYCOMP; Manufacturer1 ComponentHeight: 0.4mm; HelpURL: \\cern.ch\dfs\Applications\Altium\Datasheets\R0402_YAGEO_RC_L.pdf; Author: CERN DEM BC; CreateDate: 3/16/2021; LatestRevisionDate: 3/16/2021
R24 = R0603_200R_1%_0.1W_100PPM: Resistor - 1%; Part Description: General Purpose Thick Film Chip Resistor; Manufacturer: GENERIC; Manufacturer1 Part Number: NRC06F2000TRF; Power: 0.1W; TC: ±100ppm/°C; PressFit: No; Part Number: R0603_200R_1%_0.1W_100PPM; Component Kind: Standard; Component Type: Standard; Pin Count: 2; Value: 200; Status: Preferred; Manufacturer Part Number: R0603_200R_1%_0.1W_100PPM; Case: 0603; Mounted: Yes; Sense: No; Socket: No; SMD: Yes; Manufacturer1 Example: NIC COMPONENT; Manufacturer1 ComponentHeight: 0.55mm; HelpURL: \\cern.ch\dfs\Applications\Altium\Datasheets\R0603_NIC_NRC.pdf; Author: CERN DEM JLC; CreateDate: 12/3/2007; LatestRevisionDate: 3/13/2008
R25 = R0402_100K_0.1%_0.063W_25PPM: Resistor - 0.1%; Part Description: Thin Film Precision Resistor; Manufacturer: GENERIC; Manufacturer1 Part Number: CPF0402B100KE1; Power: 0.063W; TC: ±25ppm/°C; PressFit: No; Part Number: R0402_100K_0.1%_0.063W_25PPM; Component Kind: Standard; Component Type: Standard; Pin Count: 2; Value: 100k; Status: Not Recommended; Manufacturer Part Number: R0402_100K_0.1%_0.063W_25PPM; Case: 0402; Mounted: Yes; Sense: No; Socket: No; SMD: Yes; Manufacturer1 Example: TE CONNECTIVITY; Manufacturer1 ComponentHeight: 0.35mm; HelpURL: \\cern.ch\dfs\Applications\Altium\Datasheets\R0402_TYCO_CPF.pdf; Author: CERN DEM JMW; CreateDate: 9/22/2015; LatestRevisionDate: 9/22/2015
R26 = R0603_2K55_0.1%_0.063W_10PPM: Resistor - 0.1%; Part Description: Thin Film Chip Resistor; Manufacturer: GENERIC; Manufacturer1 Part Number: RN73C1J2K55BTDF; Power: 0.063W; TC: ±10ppm; PressFit: No; Part Number: R0603_2K55_0.1%_0.063W_10PPM; Component Kind: Standard; Component Type: Standard; Pin Count: 2; Value: 2k55; Status: Not Recommended; Manufacturer Part Number: R0603_2K55_0.1%_0.063W_10PPM; Case: 0603; Mounted: Yes; Sense: No; Socket: No; SMD: Yes; Manufacturer1 Example: TYCO HOLSWORTHY; Manufacturer1 ComponentHeight: 0.5mm; HelpURL: \\cern.ch\dfs\Applications\Altium\Datasheets\R0603_Tyco_RN73.pdf; Author: CERN DEM JLC; CreateDate: 12/3/2007; LatestRevisionDate: 3/13/2008
R28 = RCF_10R_10%_2W_-1300±300PPM_OHMITE_OY: Resistor - 10%; Part Description: Ceramic Composition Resistor - OY Series; Manufacturer: OHMITE; Manufacturer Part Number: OY100KE; Power: 2W; TC: -1300±300ppm/°C; PressFit: No; Part Number: RCF_10R_10%_2W_-1300±300PPM_OHMITE_OY; Component Kind: Standard; Component Type: Standard; Footprint: RES_OHMITE_OY; Pin Count: 2; Value: 10; Status: Not recommended; Tolerance: ±10%; Case: LS30 L22.5 x D8; Mounted: Yes; Sense: No; Socket: No; SMD: No; ComponentHeight: 8mm; HelpURL: \\cern.ch\dfs\Applications\Altium\Datasheets\RCF_OHMITE_OY.pdf; Author: CERN DEM MR; CreateDate: 5/13/2016; LatestRevisionDate: 5/13/2016
R36 = R1206_15R_1%_0.25W_100PPM: Resistor - 1%; Part Description: General Purpose Thick Film Chip Resistor; Manufacturer: GENERIC; Manufacturer1 Part Number: NRC12F15R0TRF; Power: 0.25W; TC: ±100ppm/°C; PressFit: No; Part Number: R1206_15R_1%_0.25W_100PPM; Component Kind: Standard; Component Type: Standard; Pin Count: 2; Value: 15; Status: Preferred; Manufacturer Part Number: R1206_15R_1%_0.25W_100PPM; Case: 1206; Mounted: Yes; Sense: No; Socket: No; SMD: Yes; Manufacturer1 Example: NIC COMPONENT; Manufacturer1 ComponentHeight: 0.65mm; HelpURL: \\cern.ch\dfs\Applications\Altium\Datasheets\R1206_NIC_NRC.pdf; Author: CERN DEM JLC; CreateDate: 12/3/2007; LatestRevisionDate: 3/13/2008
R43 = R0402_75R_1%_0.0625W_100PPM: Resistor - 1%; Part Description: General Purpose Thick Film Chip Resistor; Manufacturer: GENERIC; Manufacturer1 Part Number: 232270677509L; TC: ±100ppm/°C; PressFit: No; Part Number: R0402_75R_1%_0.0625W_100PPM; Component Kind: Standard; Component Type: Standard; Pin Count: 2; Value: 75; Status: Not Recommended; Power: 0.0625W; Tolerance: ±1%; Manufacturer Part Number: R0402_75R_1%_0.0625W_100PPM; Case: 0402; Mounted: Yes; Sense: No; Socket: No; SMD: Yes; Manufacturer1 Example: YAGEO PHYCOMP; Manufacturer1 ComponentHeight: 0.4mm; HelpURL: \\cern.ch\dfs\Applications\Altium\Datasheets\R0402_Phycomp_RC0402.pdf; Author: CERN DEM JLC; CreateDate: 03/12/2007; LatestRevisionDate: 17/10/2012
R90 = R0402_220R_1%_0.0625W_100PPM: Resistor - 1%; Part Description: General Purpose Thick Film Chip Resistor; Manufacturer: GENERIC; Manufacturer1 Part Number: 232270672201L; TC: ±100ppm/°C; PressFit: No; Part Number: R0402_220R_1%_0.0625W_100PPM; Component Kind: Standard; Component Type: Standard; Pin Count: 2; Value: 220; Status: Not Recommended; Power: 0.0625W; Manufacturer Part Number: R0402_220R_1%_0.0625W_100PPM; Case: 0402; Mounted: Yes; Sense: No; Socket: No; SMD: Yes; Manufacturer1 Example: YAGEO PHYCOMP; Manufacturer1 ComponentHeight: 0.4mm; HelpURL: \\cern.ch\dfs\Applications\Altium\Datasheets\R0402_Phycomp_RC0402.pdf; Author: CERN DEM JLC; CreateDate: 03.12.2007; LatestRevisionDate: 17.10.2012
SCREW1-SCREW6 = BOSSARD_BN5687-3061587_v: Screw; Part Description: M2.5 L=4mm Hexalobular Socket Pan Head Screw, Fully Threaded, Stainless Steel A2; Manufacturer Part Number: BN5687 Art.3061587; PressFit: No; ClassName: Overlapping; Part Number: BOSSARD_BN5687-3061587_v; Component Kind: Standard; Component Type: Mechanical; Pin Count: 0; PackageDescription: M2.5 L=4mm Hexalobular Socket Pan Head Screw, Fully Threaded - Stainless Steel A2; Mounted: Yes; Socket: No; SMD: No; Sense: No; Status: None; Value: M2.5x4; Manufacturer: BOSSARD; ComponentHeight: 2.1mm; HelpURL: \\cern.ch\dfs\Applications\Altium\Datasheets\BOSSARD_BN5687-3061587.pdf; Author: CERN DEM JLC; CreateDate: 22.08.2013; LatestRevisionDate: 22.08.2013
T1 = BC857B: PNP Transistor; Part Description: -45V -100mA PNP General-Purpose Transistors; Manufacturer: NXP SEMICONDUCTORS; PressFit: No; Bonding: No; Part Number: BC857B; Component Kind: Standard; Component Type: Standard; Device: BC857B; PackageDescription: SOT23, 0.95mm Pitch; 3 Pin, 1.30mm W X 2.90mm L X 1.10mm H body, IPC Medium Density; Manufacturer Part Number: BC857B; Pin Count: 3; Case: SOT23-3; Mounted: Yes; Socket: No; SMD: Yes; Sense: No; ComponentHeight: 1.1mm; HelpURL: \\cern.ch\dfs\Applications\Altium\Datasheets\BC857B.pdf; Author: CERN DEM JLC; CreateDate: 6/14/2011; LatestRevisionDate: 6/14/2011
T3 = BC847C: NPN Transistor; Part Description: 45V 100mA NPN Silicon AF Transistor; Manufacturer: INFINEON; PressFit: No; Bonding: No; Part Number: BC847C; Component Kind: Standard; Component Type: Standard; Device: BC847C; PackageDescription: SOT23, 0.95mm Pitch; 3 Pin, 1.40mm W X 3.00mm L X 1.10mm H body, IPC Medium Density; Manufacturer Part Number: BC847C; Pin Count: 3; Case: SOT23-3; Mounted: Yes; Socket: No; SMD: Yes; Sense: No; ComponentHeight: 1.1mm; HelpURL: \\cern.ch\dfs\Applications\Altium\Datasheets\BC847C.pdf; Author: CERN DEM JLC; CreateDate: 9/23/2014; LatestRevisionDate: 9/23/2014
T5 = BSC600N25NS3GATMA1: MOSFET Transistor, N Channel, 25 A, 250 V, 0.05 ohm, 10 V, 3 V; Manufacturer: Infineon; Continuous Drain Current (ID): 25A; Drain to Source Resistance: 60mΩ; Drain to Source Voltage (Vdss): 250V; Gate to Source Voltage (Vgs): 20V; Input Capacitance: 1.77nF; Max Power Dissipation: 125W; Number of Elements: 1; Rise Time: 10ns; Supplier: DigiKey; Supplier Part Number: BSC600N25NS3GATMA1CT-ND; Manufacturer Part Number: BSC600N25NS3GATMA1; RoHS: Compliant; Category: MOSFETs; Stock: 12980; Pricing: 1=4.08, 10=2.681, 100=1.8868, 500=1.70212, 5000=1.39062 (USD); China RoHS: Non-Compliant; Contact Plating: Tin; Country of Origin: Malaysia; Export Control Classification Number (ECCN) Code: EAR99; Halogen Free: Halogen Free; Introduction Date: 2009-10-23; Lead Free: Contains Lead; Lifecycle Status: Production; Max Dual Supply Voltage: 250V; Max Operating Temperature: 150°C; Min Breakdown Voltage: 250V; Min Operating Temperature: -55°C; Mounting Technology: Surface Mount; Pins: 8; Number of Terminals: 8; On-State Resistance: 60mΩ; Package Quantity: 5000; Packaging: Tape & Reel; Power Dissipation: 125W; REACH SVHC: No; Schedule B: 8541290080, 8541290080|8541290080|8541290080|8541290080|8541290080; ComponentLink1URL: https://datasheet.octopart.com:443/BSC600N25NS3GATMA1-Infineon-datasheet-13720809.pdf?src-supplier=Newark; ComponentLink1Description: https://datasheet.octopart.com:443/BSC600N25NS3GATMA1-Infineon-datasheet-13720809.pdf?src-supplier=Newark; ComponentLink2URL: https://datasheet.octopart.com:443/BSC600N25NS3-G-Infineon-datasheet-11795221.pdf?src-supplier=Farnell; ComponentLink2Description: https://datasheet.octopart.com:443/BSC600N25NS3-G-Infineon-datasheet-11795221.pdf?src-supplier=Farnell; ComponentLink3URL: http://sigma.octopart.com:80/conflict_mineral_statement/Infineon-company-51.pdf?src-supplier=Compliance+Statements; ComponentLink3Description: http://sigma.octopart.com:80/conflict_mineral_statement/Infineon-company-51.pdf?src-supplier=Compliance+Statements
T6 T7 = BSS138LT1G: N-CHANNEL MOSFET WITH DIODE; Part Description: 50V 200mA N-Channel Enhancement Mode Field-Effect Transistor; Manufacturer1: ON SEMICONDUCTOR; PressFit: No; Bonding: No; Part Number: BSS138LT1G; Component Kind: Standard; Component Type: Standard; Device: BSS138LT1G; PackageDescription: SOT23 3-Leads, Pitch 0.95mm - Body 1.4x3mm, IPC Medium Density; Manufacturer1 Part Number: BSS138LT1G; Pin Count: 3; Case: SOT23-3; Mounted: Yes; Socket: No; SMD: Yes; Sense: No; ComponentHeight: 1.11mm; HelpURL: \\cern.ch\dfs\Applications\Altium\Datasheets\BSS138LT1G.pdf; Author: CERN DEM JLC; CreateDate: 23.03.2009; LatestRevisionDate: 23.03.2009